# Altium schematic sheet MT6815.SchDoc
size A4
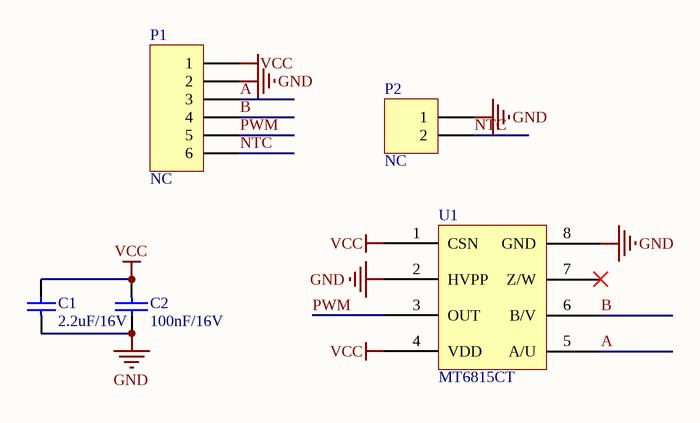
[diagram p0: MT6815.SchDoc]

## Parts
C1  2.2uF/16V  [C0603]
C2  100nF/16V  [C0402]
P1  NC  [HDR1X6]
P2  NC  [HDR1X2]
U1  MT6815CT  [SOIC-8]

## Nets
GND: C1.1 C2.2 P1.2 P2.1 U1.2(HVPP) U1.8(GND)
VCC: C1.2 C2.1 P1.1 U1.1(CSN) U1.4(VDD)
A: P1.3 U1.5(A/U)
B: P1.4 U1.6(B/V)
NTC: P1.6 P2.2
PWM: P1.5 U1.3(OUT)

Not connected (* = marked no-connect by the designer): U1 7(Z/W)*

## Library data of the parts
C1 = cap
C2 = CAP: Capacitor
P1 = Header 6: Header, 6-Pin; LatestRevisionDate: 17-Jul-2002; LatestRevisionNote: Re-released for DXP Platform.; Publisher: Altium Limited
P2 = Header 2: Header, 2-Pin; LatestRevisionDate: 17-Jul-2002; LatestRevisionNote: Re-released for DXP Platform.; Publisher: Altium Limited